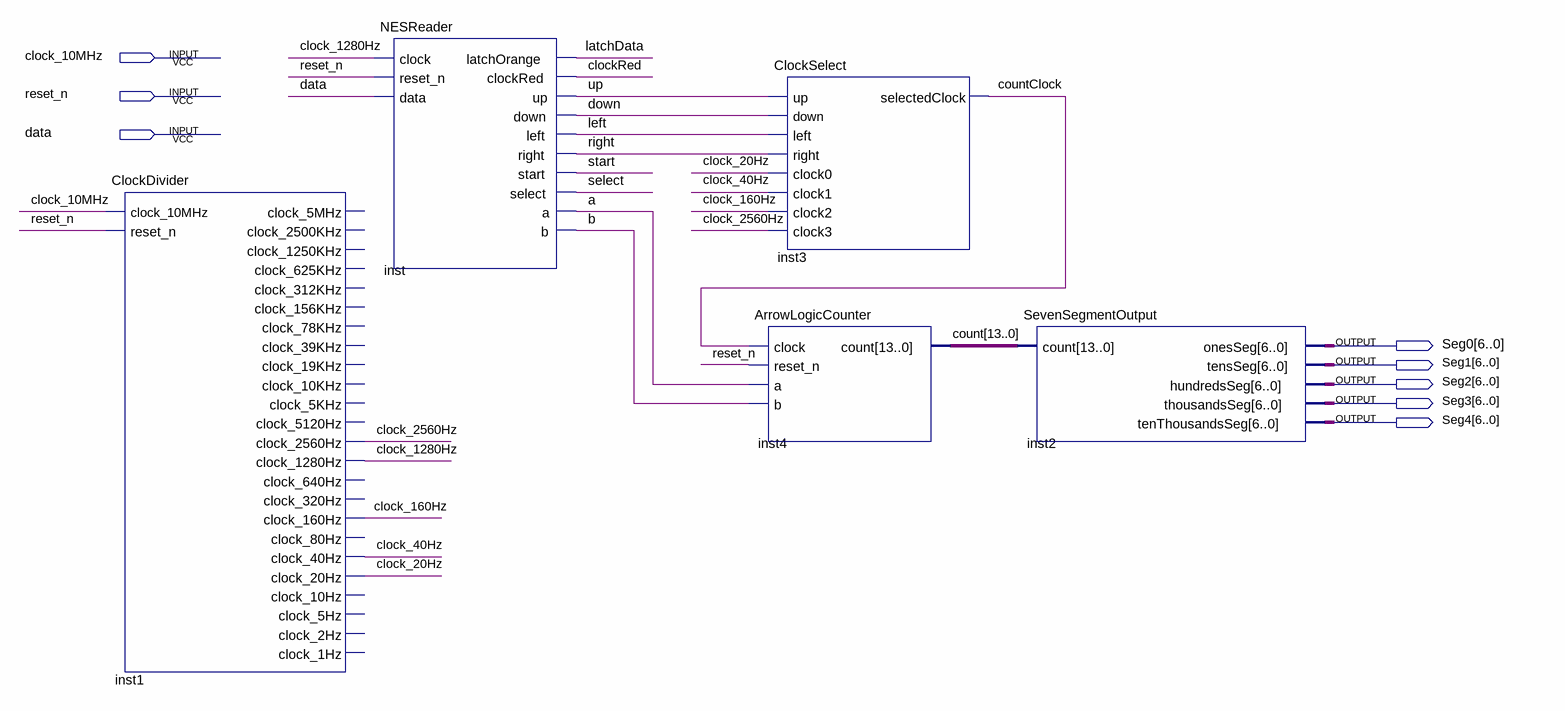
[diagram p0: schematic sheet]
// Quartus schematic NESController.bdf as structural Verilog: 5 symbols, 8 pins
module NESController (
  input  clock_10MHz,
  input  reset_n,
  input  data,
  output [6:0] Seg0,
  output [6:0] Seg1,
  output [6:0] Seg2,
  output [6:0] Seg3,
  output [6:0] Seg4
);

  wire a, b, clock_20Hz, clock_40Hz, clock_160Hz, clock_1280Hz, clock_2560Hz, clockRed, countClock, down,
       latchData, left, right, select, start, up;
  wire [13:0] count;

  ClockDivider inst1 (
    .clock_10MHz(clock_10MHz), .reset_n(reset_n), .clock_2560Hz(clock_2560Hz), .clock_1280Hz(clock_1280Hz),
    .clock_160Hz(clock_160Hz), .clock_40Hz(clock_40Hz), .clock_20Hz(clock_20Hz));  // open: clock_5MHz, clock_2500KHz, clock_1250KHz, clock_625KHz, clock_312KHz, clock_156KHz, clock_78KHz, clock_39KHz, clock_19KHz, clock_10KHz, clock_5KHz, clock_5120Hz, clock_640Hz, clock_320Hz, clock_80Hz, clock_10Hz, clock_5Hz, clock_2Hz, clock_1Hz
  NESReader inst (
    .clock(clock_1280Hz), .reset_n(reset_n), .data(data), .latchOrange(latchData), .clockRed(clockRed),
    .up(up), .down(down), .left(left), .right(right), .start(start), .select(select), .a(a), .b(b));
  ClockSelect inst3 (
    .up(up), .down(down), .left(left), .right(right), .clock0(clock_20Hz), .clock1(clock_40Hz),
    .clock2(clock_160Hz), .clock3(clock_2560Hz), .selectedClock(countClock));
  ArrowLogicCounter inst4 (.clock(countClock), .reset_n(reset_n), .a(a), .b(b), .count(count));
  SevenSegmentOutput inst2 (
    .count(count), .onesSeg(Seg0), .tensSeg(Seg1), .hundredsSeg(Seg2), .thousandsSeg(Seg3),
    .tenThousandsSeg(Seg4));
endmodule
